# Altium project CH340G_VCC.PrjPcb
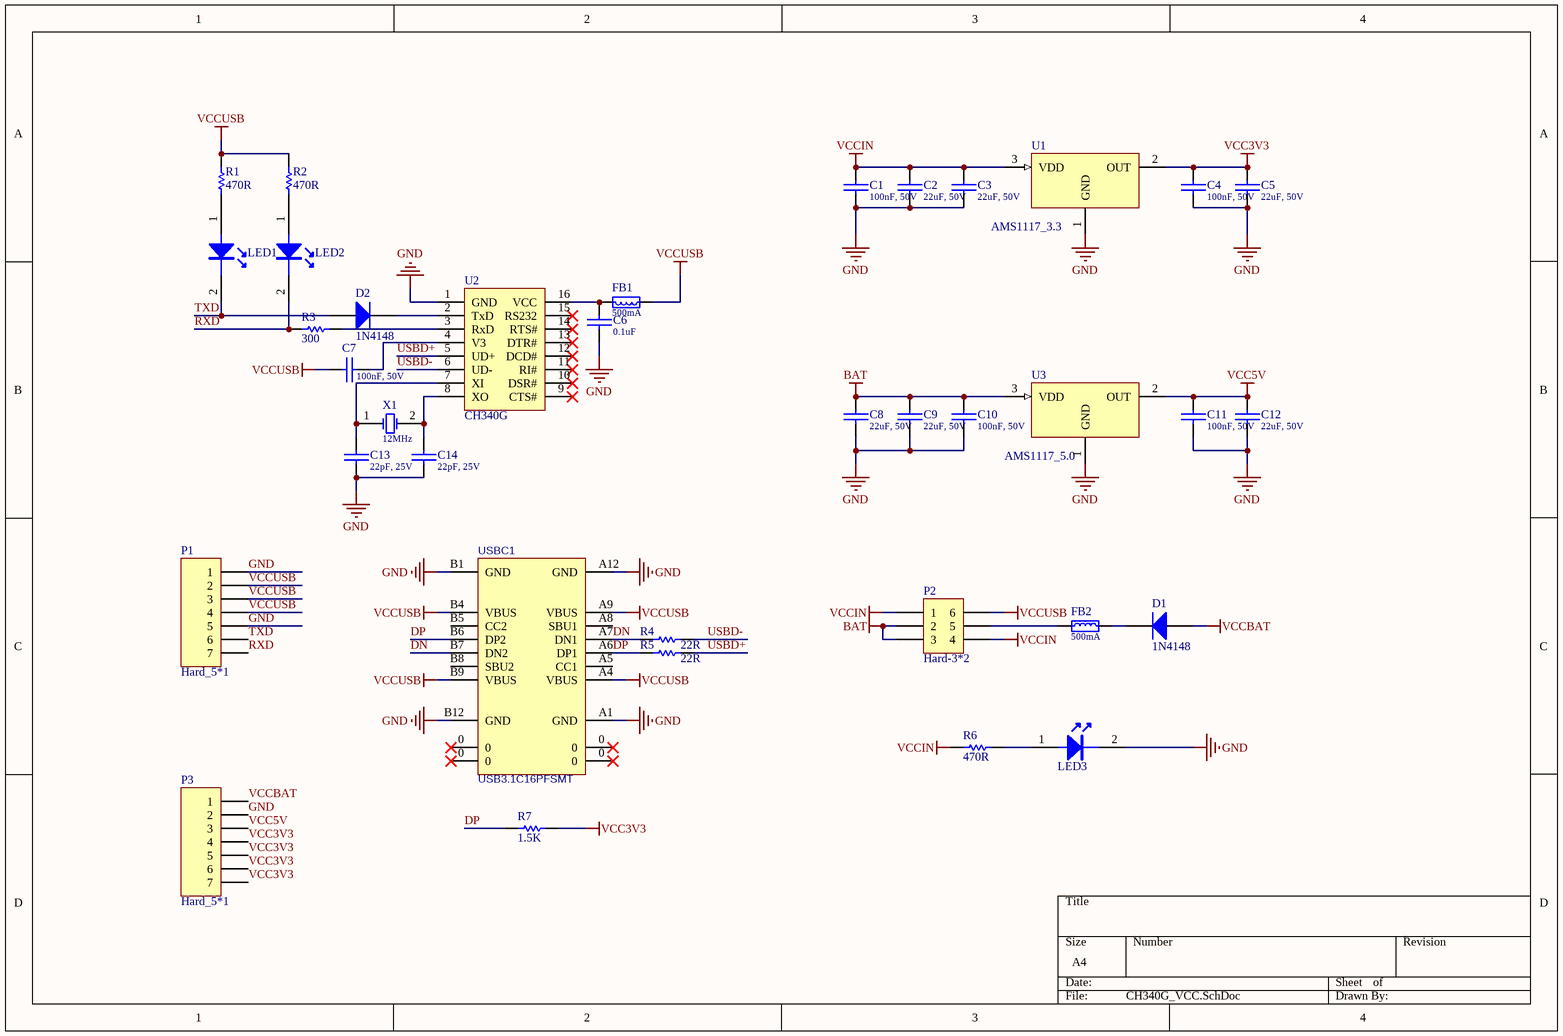
[diagram p0: CH340G_VCC.SchDoc]
1 sheet, 36 parts. Net scope: global (net labels, ports and power ports of the same name join across sheets).
Board file: CH340G_VCC.PcbDoc

## Sheet CH340G_VCC.SchDoc
size A4

### Parts
C1  value 100nF, 50V  [C0603_QB]  (hidden comment: CC0603KRX7R9BB104)
C2  value 22uF, 50V  [C0805_1.25mm_QB]  (hidden comment: CC0603KRX7R9BB104)
C3  value 22uF, 50V  [C0805_1.25mm_QB]  (hidden comment: CC0603KRX7R9BB104)
C4  value 100nF, 50V  [C0603_QB]  (hidden comment: CC0603KRX7R9BB104)
C5  value 22uF, 50V  [C0805_1.25mm_QB]  (hidden comment: CC0603KRX7R9BB104)
C6  value 0.1uF  [C0603_QB]  (hidden comment: CC0603KRX7R9BB104)
C7  value 100nF, 50V  [C0603_QB]  (hidden comment: CC0603KRX7R9BB104)
C8  value 22uF, 50V  [C0805_1.25mm_QB]  (hidden comment: CC0603KRX7R9BB104)
C9  value 22uF, 50V  [C0805_1.25mm_QB]  (hidden comment: CC0603KRX7R9BB104)
C10  value 100nF, 50V  [C0603_QB]  (hidden comment: CC0603KRX7R9BB104)
C11  value 100nF, 50V  [C0603_QB]  (hidden comment: CC0603KRX7R9BB104)
C12  value 22uF, 50V  [C0805_1.25mm_QB]  (hidden comment: CC0603KRX7R9BB104)
C13  value 22pF, 25V  [C0603_QB]  (hidden comment: CC0603KRX7R9BB104)
C14  value 22pF, 25V  [C0603_QB]  (hidden comment: CC0603KRX7R9BB104)
D1  1N4148  [SOD_523_QB]
D2  1N4148  [SOD_523_QB]
FB1  value 500mA  [FB0603_QB]  (hidden comment: CBG160808U182)
FB2  value 500mA  [FB0603_QB]  (hidden comment: CBG160808U182)
LED1  19-217/R6C-AL1M2VY/3T  [LED_SMT_QB]  (value not drawn)
LED2  19-217/R6C-AL1M2VY/3T  [LED_SMT_QB]  (value not drawn)
LED3  19-217/R6C-AL1M2VY/3T  [LED_SMT_QB]  (value not drawn)
P1  Hard_5*1  [HDR2.54-LI-4P]
P2  Hard-3*2  [HDR2.54-LI-2x3P]
P3  Hard_5*1  [HDR2.54-LI-4P]
R1  value 470R  [R0603_QB]  (hidden comment: RC0603JR-07470RL)
R2  value 470R  [R0603_QB]  (hidden comment: RC0603JR-07470RL)
R3  value 300  [R0603_QB]  (hidden comment: RC0603JR-07470RL)
R4  value 22R  [C0603_QB]  (hidden comment: RC0603JR-07470RL)
R5  value 22R  [C0603_QB]  (hidden comment: RC0603JR-07470RL)
R6  value 470R  [R0603_QB]  (hidden comment: RC0603JR-07470RL)
R7  value 1.5K  [R0603_QB]  (hidden comment: RC0603JR-07470RL)
U1  value AMS1117_3.3  [SOT_89_QB]  (hidden comment: AMS1117(SOT-89))
U2  CH340G  [SOP16N_N]
U3  value AMS1117_5.0  [SOT_89_QB]  (hidden comment: AMS11175.0(SOT-89))
USBC1  USB3.1C16PFSMT  [TYPE-C-USB-17]
X1  12MHz  [ESB3.68640F20M23_QB]

### Nets
BAT: C8.2 C9.2 C10.2 P2.2 P2.3 U3.3(VDD)
GND: C1.1 C2.1 C3.1 C4.1 C5.1 C6.1 C8.1 C9.1 C10.1 C11.1 C12.1 C13.1 C14.1 LED3.2(K) P1.1 P1.5 P3.2 U1.1(GND) U2.1(GND) U3.1(GND) USBC1.A1(GND) USBC1.A12(GND) USBC1.B1(GND) USBC1.B12(GND)
VCC3V3: C4.2 C5.2 P3.4 P3.5 P3.6 P3.7 R7.2 U1.2(OUT)
VCC5V: C11.2 C12.2 P3.3 U3.2(OUT)
VCCBAT: D1.1(A) P3.1
VCCIN: C1.2 C2.2 C3.2 P2.1 P2.4 R6.1 U1.3(VDD)
VCCUSB: C7.1 FB1.1 P1.2 P1.3 P1.4 P2.6 R1.2 R2.2 USBC1.A4(VBUS) USBC1.A9(VBUS) USBC1.B4(VBUS) USBC1.B9(VBUS)
DN: R4.1 USBC1.A7(DN1) USBC1.B7(DN2)
DP: R5.1 R7.1 USBC1.A6(DP1) USBC1.B6(DP2)
RXD: LED2.2(K) P1.7 R3.1
TXD: D2.1(A) LED1.2(K) P1.6
USBD+: R5.2 U2.5(UD+)
USBD-: R4.2 U2.6(UD-)
NetC6_2: C6.2 FB1.2 U2.16(VCC)
NetC7_2: C7.2 U2.4(V3)
NetC13_2: C13.2 U2.7(XI) X1.1(OSC1)
NetC14_2: C14.2 U2.8(XO) X1.2(OSC2)
NetD1_2: D1.2(K) FB2.2
NetD2_2: D2.2(K) U2.2(TxD)
NetFB2_1: FB2.1 P2.5
NetLED1_1: LED1.1(A) R1.1
NetLED2_1: LED2.1(A) R2.1
NetLED3_1: LED3.1(A) R6.2
NetR3_2: R3.2 U2.3(RxD)

Not connected (* = marked no-connect by the designer): U2 9(CTS#)* 10(DSR#)* 11(RI#)* 12(DCD#)* 13(DTR#)* 14(RTS#)* 15(RS232)*; USBC1 0* A5(CC1) A8(SBU1) B5(CC2) B8(SBU2)

### Library data of the parts
C1-C14 = CAP: Capacitor; Manufacturer: 国巨; PartNo: 11002050002
D1 D2 = diode
FB1 FB2 = FB: Inductor; Manufacturer: HOLDER; PartNo_new: 11014060007
LED1-LED3 = LED: Manufacturer: 亿光; PartNo: 11004030004; Value: 5V，25mA，红色，0603
R1-R7 = Res1: Resistor; Manufacturer: 国巨; PartNo: 11003020066
U1 = MD5333: LDO; Manufacturer: 明达微; PartNo: 11001090038
U3 = MD5350: LDO; Manufacturer: 明达微; PartNo: 11001090038
X1 = XTAL: Crystal Oscillator; Manufacturer: EPSON; PartNo: 11012040004; Value: FC-135,32.768KHz,12.5pF,20ppm